# EAGLE design Horn_Board (EAGLE 9.0.1)
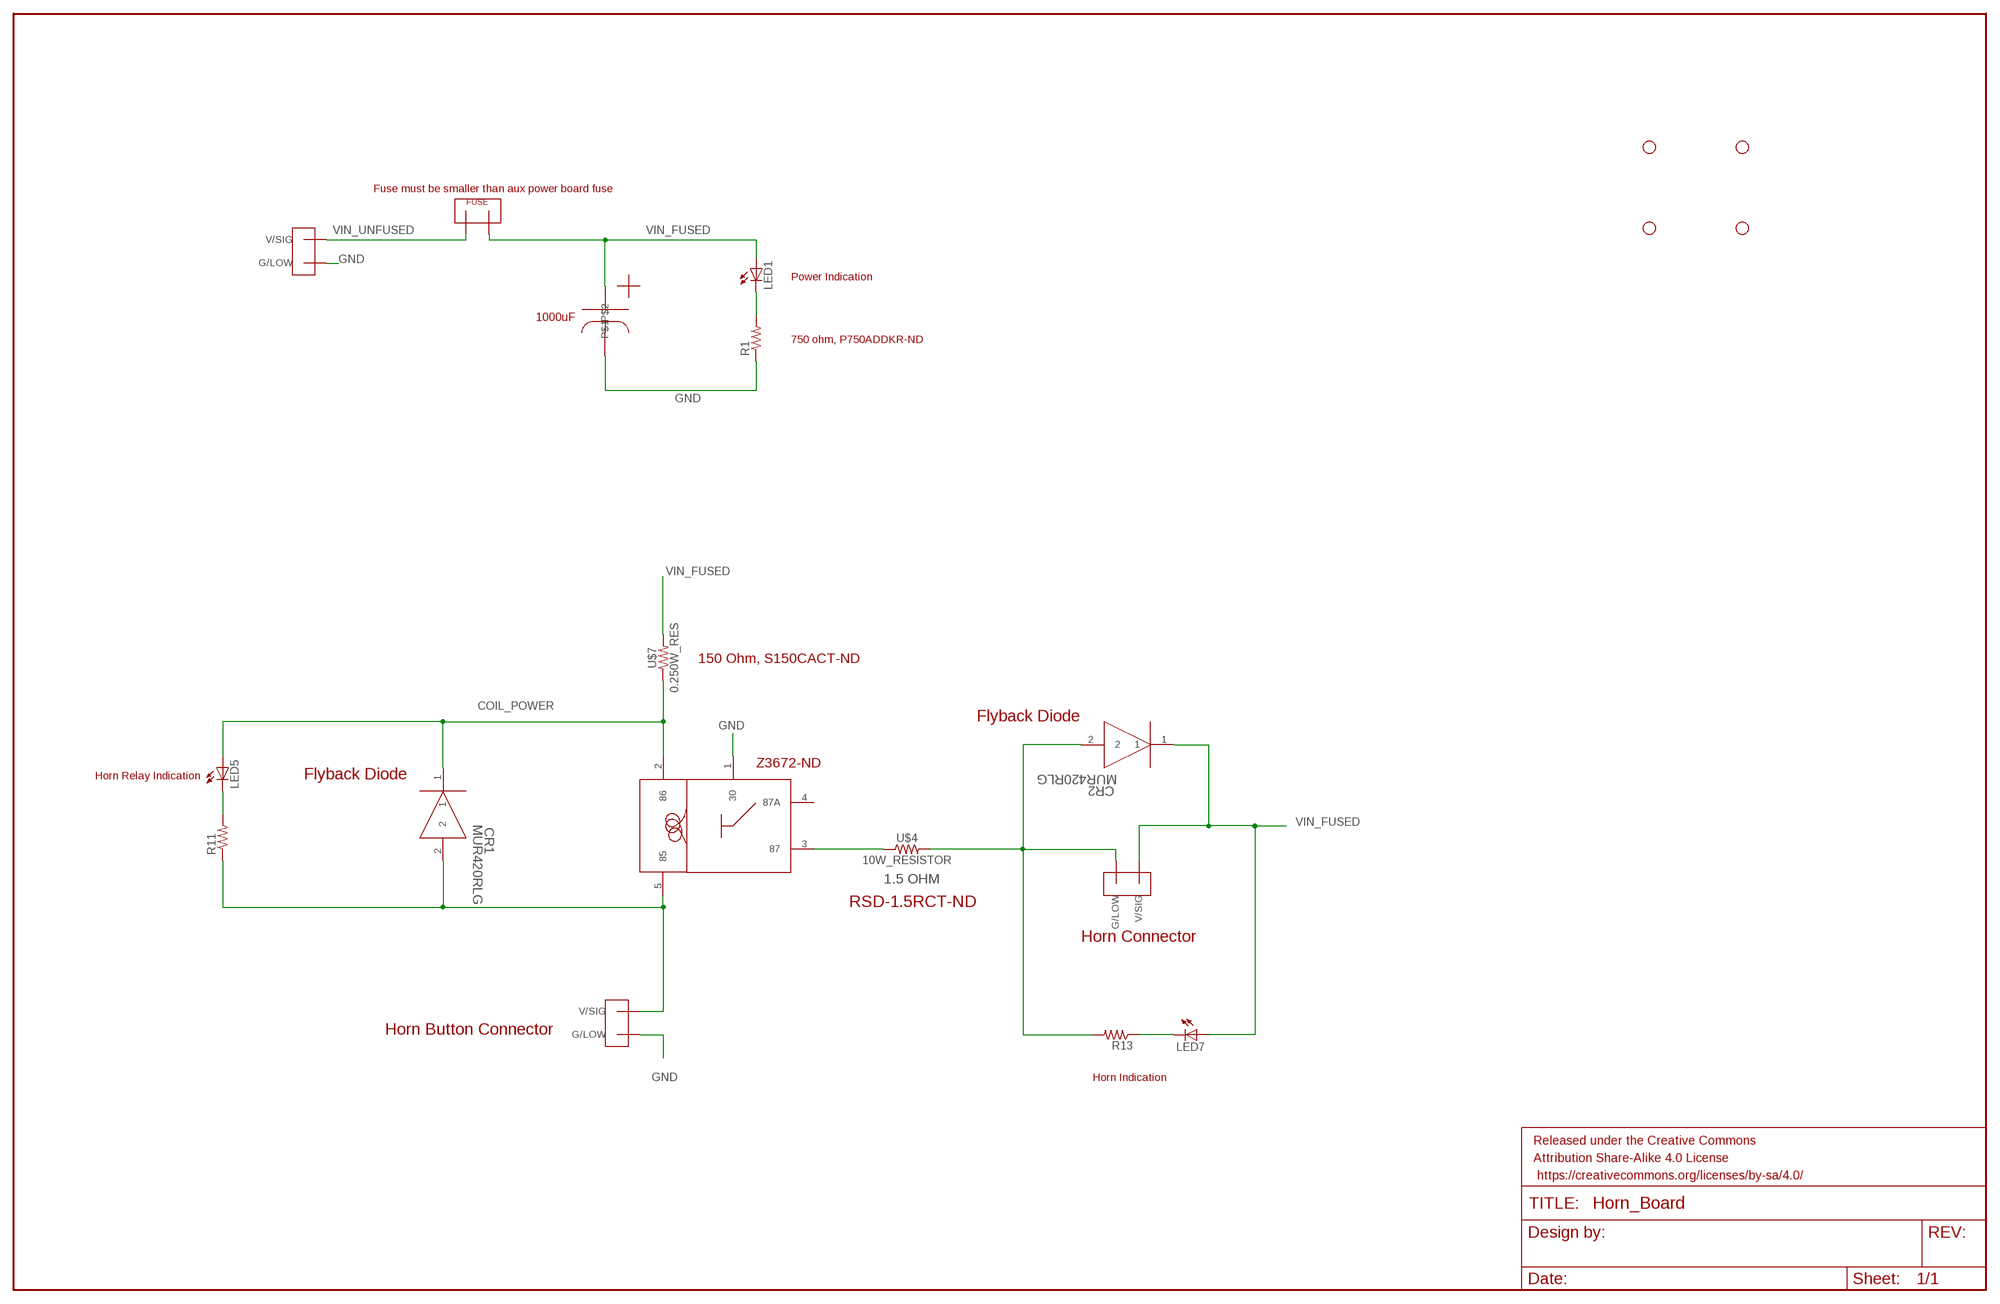
[diagram p0: schematic, sheet 1]

## Parts
CR1  MUR420RLG  [DO-201AD]
CR2  MUR420RLG  [DO-201AD]
FRAME1  FRAME-LEDGER  [CREATIVE_COMMONS]
H1  STAND-OFF  [STAND-OFF]
H2  STAND-OFF  [STAND-OFF]
H3  STAND-OFF  [STAND-OFF]
H4  STAND-OFF  [STAND-OFF]
LED1  LEDCHIP-LED0805  [CHIP-LED0805]
LED5  LEDCHIP-LED0805  [CHIP-LED0805]
LED7  LEDCHIP-LED0805  [CHIP-LED0805]
R1  R-US_M0805  [M0805]
R11  R-US_M0805  [M0805]
R13  R-US_M0805  [M0805]
U$1  TE770966  [2X1-MATE-N-LOCK]
U$2  FUSEMINI-BLADE  [MINI-BLADE-FUSE]
U$3  OMRON_G5LE-1  [OMRON_G5LE-1]
U$4  10W_RESISTOR  [10W_RESISTOR]
U$7  0.250W_RES  [AXIAL-0.3]
U$17  TE770966  [2X1-MATE-N-LOCK]
U$18  TE770966  [2X1-MATE-N-LOCK]
U$22  CAPESK108M025AH4EA  [ESK108M025AH4EA]

## Nets
COIL_POWER: CR1.1 LED5.A U$3.2 U$7.P$1
GND: R1.1 U$1.CIRCUIT2(G/LOW) U$3.1 U$17.CIRCUIT2(G/LOW) U$22.P$2
HORN-: CR2.2 R13.2 U$4.P$2 U$18.CIRCUIT2(G/LOW)
HORN_BUTTON: CR1.2 R11.1 U$3.5 U$17.CIRCUIT1(V/SIG)
N$1: U$3.3 U$4.P$1
N$5: LED1.C R1.2
N$18: LED5.C R11.2
N$20: LED7.C R13.1
VIN_FUSED: CR2.1 LED1.A LED7.A U$2.OUT U$7.P$2 U$18.CIRCUIT1(V/SIG) U$22.P$1
VIN_UNFUSED: U$1.CIRCUIT1(V/SIG) U$2.IN
Unconnected: U$3.4(87A)

## Notes on the sheet
- Fuse must be smaller than aux power board fuse
- Power Indication
- 1000uF
- 750 ohm, P750ADDKR-ND
- 150 Ohm, S150CACT-ND
- Flyback Diode
- Z3672-ND
- Horn Relay Indication | Flyback Diode
- 1.5 OHM
- RSD-1.5RCT-ND
- Horn Connector
- Horn Button Connector
- Horn Indication

## Library data of the parts
CR1 CR2 = MUR420RLG - Diode:MUR420RLG; MANUFACTURER_PART_NUMBER: MUR420RLG; VENDOR: ON Semiconductor
FRAME1 = SparkFun-Aesthetics:FRAME-LEDGER: Schematic Frame - Ledger Standard 11x14 US Ledger frame
H1-H4 = SparkFun-Electromechanical:STAND-OFF: #4 Stand Off This is the mechanical footprint for a #4 phillips button head screw. Use the keepout ring to avoid running the screw head into surrounding components. SKU : PRT-00447
LED1 LED5 LED7 = led:LED: LED OSRAM: - CHIPLED LG R971, LG N971, LY N971, LG Q971, LY Q971, LO R971, LY R971 LH N974, LH R974 LS Q976, LO Q976, LY Q976 LO Q996 - Hyper CHIPLED LW Q18S LB Q993, LB Q99A, LB R99A - SideLED LS A670, LO A670, LY A670, LG A670, LP A670 LB A673, LV A673, LT A673, LW A673 LH A674 LY A675 LS A676, LA A676, LO A676, LY A676, LW A676 LS A679, LY A679, LG A679 - Hyper Micro SIDELED® LS Y876, LA Y876, LO Y876, LY Y876 LT Y87S - SmartLED LW L88C, LW L88S LB L89C, LB L89S, LG L890 LS L89K, LO L89K, LY L89K LS L896, LA L896, LO L896, LY L896 - TOPLED LS T670, LO T670, LY T670, LG T670, LP T670 LSG T670, LSP T670, LSY T670, LOP T670, LYG T670 LG T671, LOG T671, LSG T671 LB T673, LV T673, LT T673, LW T673 LH T674 LS T676, LA T676, LO T676, LY T676, LB T676, LH T676, LSB T676, LW T676 LB T67C, LV T67C, LT T67C, LS T67K, LO T67K, LY T67K, LW E67C LS E67B, LA E67B, LO E67B, LY E67B, LB E67C, LV E67C, LT E67C LW T67C LS T679, LY T679, LG T679 LS T770, LO T770, LY T770, LG T770, LP T770 LB T773, LV T773, LT T773, LW T773 LH T774 LS E675, LA E675, LY E675, LS T675 LS T776, LA T776, LO T776, LY T776, LB T776 LHGB T686 LT T68C, LB T68C - Hyper Mini TOPLED® LB M676 - Mini TOPLED Santana® LG M470 LS M47K, LO M47K, LY M47K Source: http://www.osram.convergy.de LUXEON: - LUMILED® LXK2-PW12-R00, LXK2-PW12-S00, LXK2-PW14-U00, LXK2-PW14-V00 LXK2-PM12-R00, LXK2-PM12-S00, LXK2-PM14-U00 LXK2-PE12-Q00, LXK2-PE12-R00, LXK2-PE12-S00, LXK2-PE14-T00, LXK2-PE14-U00 LXK2-PB12-K00, LXK2-PB12-L00, LXK2-PB12-M00, LXK2-PB14-N00, LXK2-PB14-P00, LXK2-PB14-Q00 LXK2-PR12-L00, LXK2-PR12-M00, LXK2-PR14-Q00, LXK2-PR14-R00 LXK2-PD12-Q00, LXK2-PD12-R00, LXK2-PD12-S00 LXK2-PH12-R00, LXK2-PH12-S00 LXK2-PL12-P00, LXK2-PL12-Q00, LXK2-PL12-R00 Source: www.luxeon.com KINGBRIGHT: KA-3528ASYC Source: www.kingbright.com
R1 R11 R13 = rcl:R-US_: RESISTOR, American symbol; SPICEPREFIX: R
U$1 U$17 U$18 = Shell2013(1):TE770966
U$2 = Shell2013:FUSE
U$3 = Eagle Library:OMRON_G5LE-1
U$4 = Eagle Library:10W_RESISTOR
U$7 = Eagle Library:0.250W_RES
U$22 = Shell2015:CAP

## Board
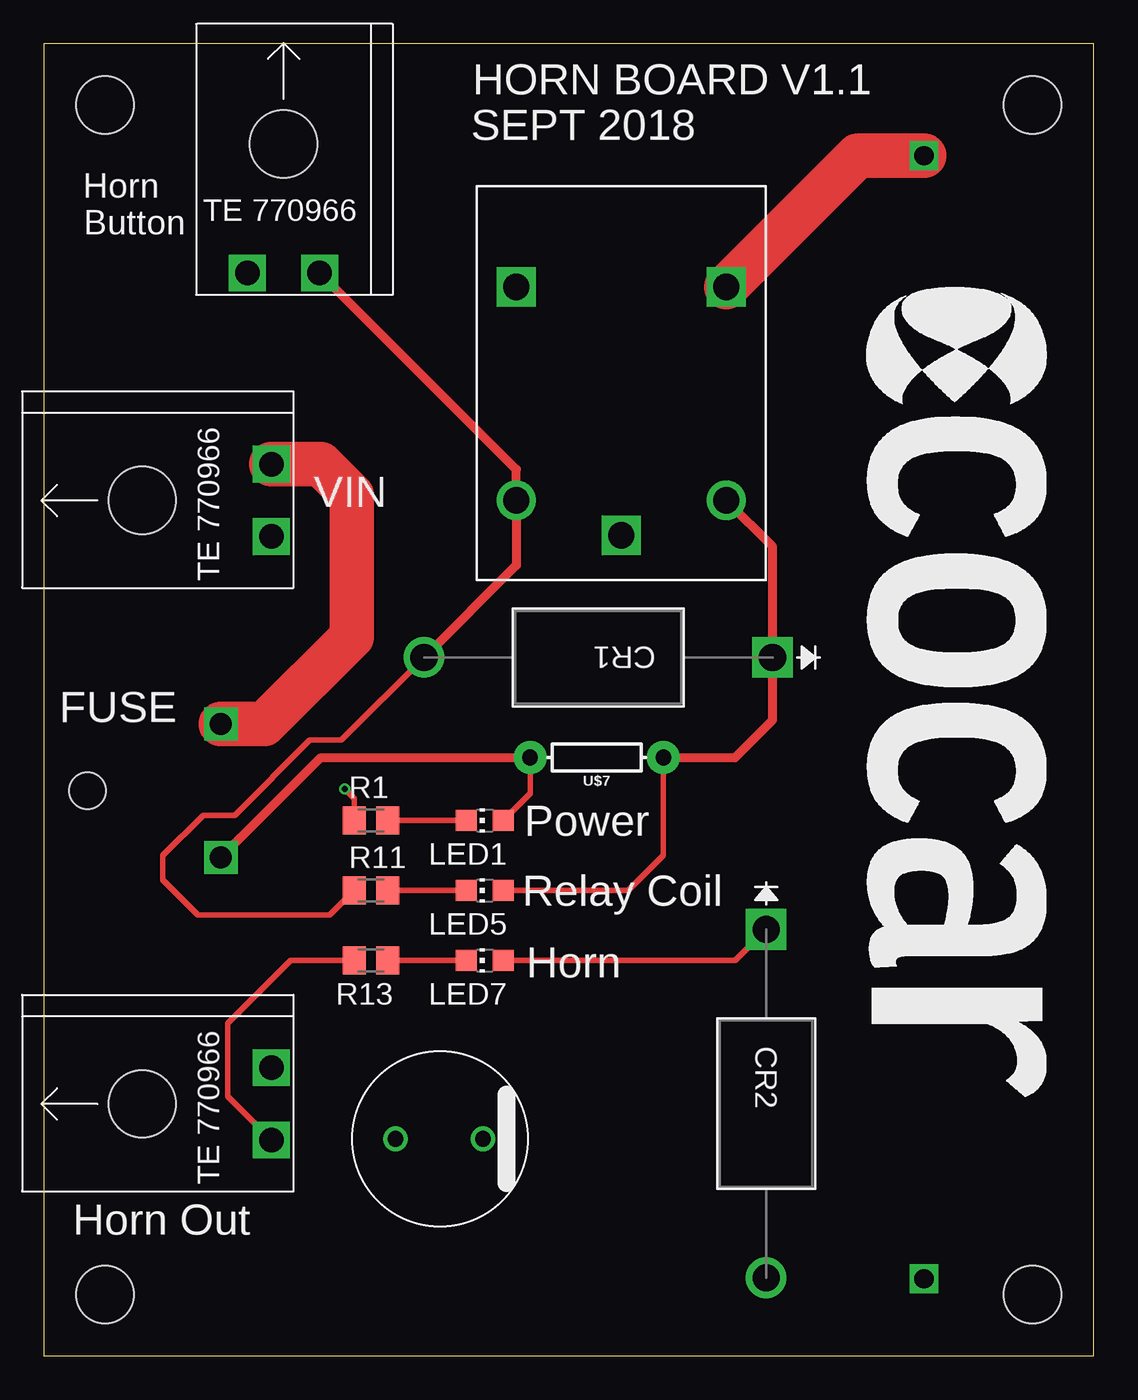
[diagram p1: board, top side]
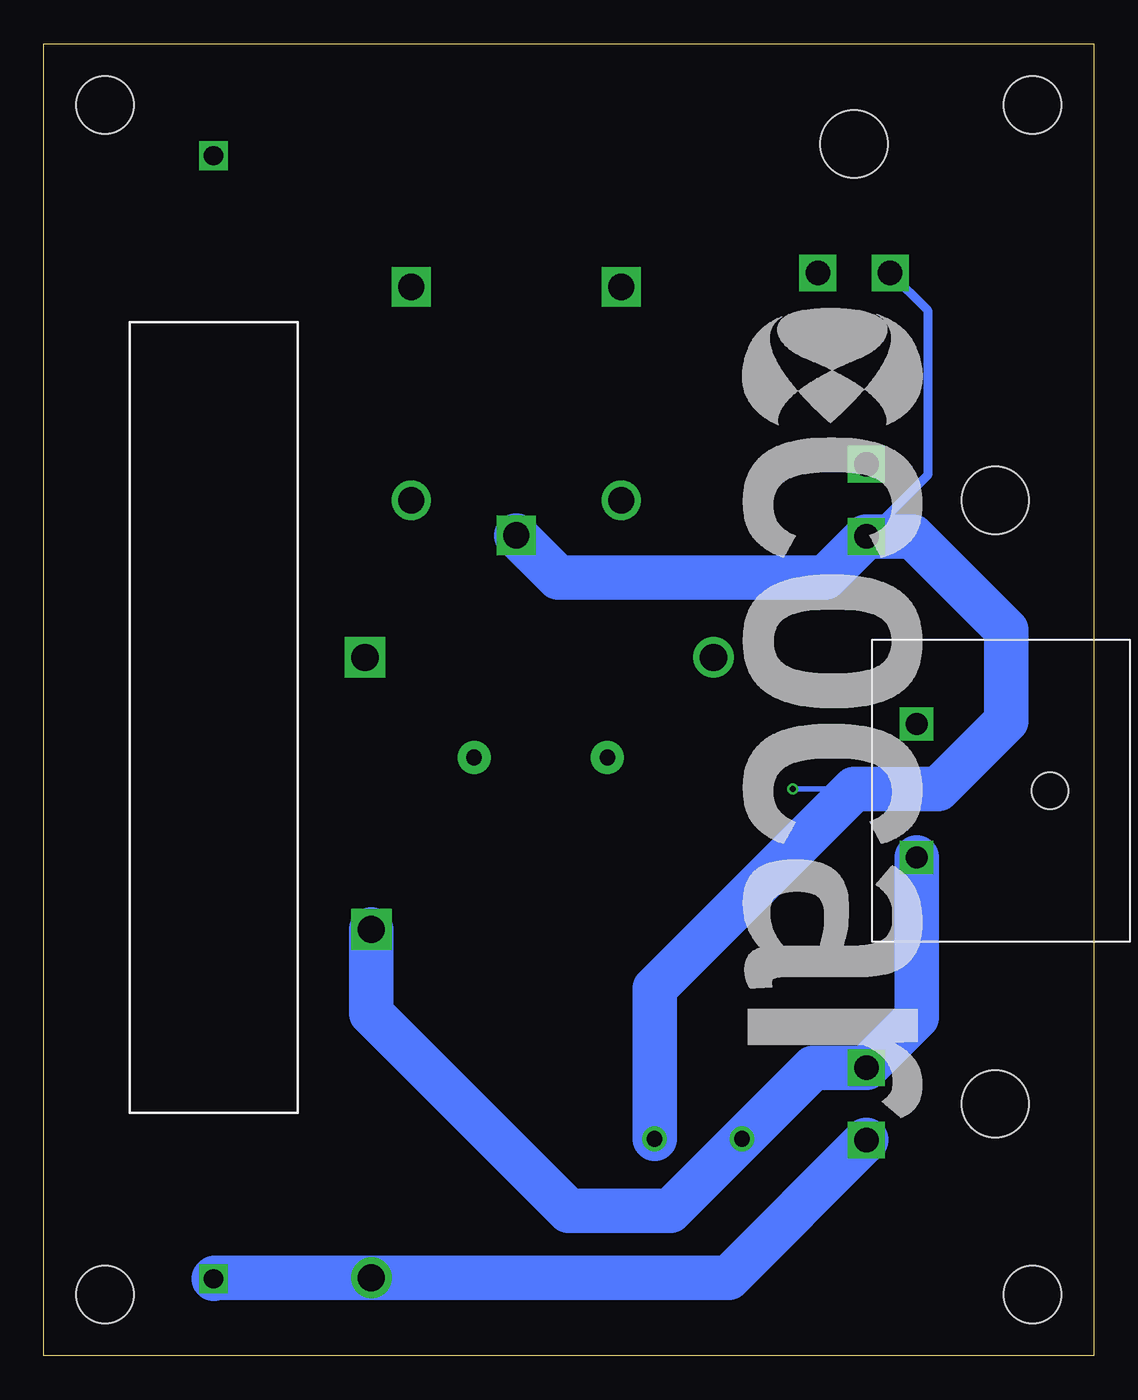
[diagram p2: board, bottom side, seen from below]

Size 60 x 75 mm. Coordinates in mm from the lower left corner, seen from the top.
Outline: 0,0 60,0 60,75 0,75 0,0
Copper layers (1*16): Top 0.035mm / dielectric 1.5mm / Bottom 0.035mm
Design rules "SeeedStudio_2layer_DRU_no_angle_20140221": minimum track width 6mil, minimum drill 12mil, track to track 6mil, track to pad 6mil, pad to pad 6mil, via to via 6mil, smd to smd 0mil, copper to edge 10mil, drill to drill 10mil, minimum pad ring 10mil, minimum via ring 6mil, stop-mask expansion 2mil, vias tented up to drill 100mil, thermal gap 10mil

### Footprints (pad centres in the part's own frame; a part is rotated, then mirrored left to right if it is on the bottom)
DO-201AD = drill 1.549 pad 2.057 square: 1 -19.914,0 | drill 1.549 pad 2.057: 2 0,0
STAND-OFF = hole 3.302: 0,0
CHIP-LED0805 = smd 1.2 x 1.2: A 0,-1.05; C 0,1.05
M0805 = smd 1.3 x 1.6: 1 -0.95,0; 2 0.95,0
2X1-MATE-N-LOCK = drill 1.4 square: CIRCUIT1 -2.07,14.23; CIRCUIT2 2.07,14.23 | hole 3.86: 0,6.86
MINI-BLADE-FUSE = drill 1.27 square: IN 3.81,7.62; OUT -3.81,7.62 | hole 2.083: 0,0
OMRON_G5LE-1 = drill 1.5 square: 1 -8.7,0; 3 5.5,-6; 4 5.5,6 | drill 1.5: 2 -6.7,-6; 5 -6.7,6
10W_RESISTOR = drill 1.1 square: P$1 0,32.1; P$2 0,-32.1
AXIAL-0.3 = drill 0.9 pad 1.88: P$1 -3.81,0; P$2 3.81,0
ESK108M025AH4EA = drill 0.9: P$1 0,0; P$2 5,0

### Placement (x,y rotation side)
CR1  21.73,39.92 180 top
CR2  41.28,4.46 270 top
FRAME1  -80.01,69.85 0 top  (outside the outline)
H1  56.5,71.5 0 top
H2  56.5,3.5 0 top
H3  3.5,71.5 0 top
H4  3.5,3.5 0 top
LED1  25.2,30.6 90 top
LED5  25.2,26.6 90 top
LED7  25.2,22.6 90 top
R1  18.7,30.6 0 top
R11  18.7,26.6 0 top
R13  18.7,22.6 180 top
U$1  -1.23,48.9 270 top
U$2  2.5,32.3 90 bottom
U$3  33,55.6 90 top
U$4  50.3,36.5 0 bottom
U$5  [ECOCAR_LOGO_2018]  20.1,59.9 270 bottom
U$7  31.6,34.2 180 top
U$14  [ECOCAR_LOGO_2018]  47,61.1 270 top
U$17  13.7,76.13 180 top
U$18  -1.23,14.4 270 top
U$22  20.1,12.4 0 top

### Tracks (layer width: path | path; a pad name or v marks a point on that pad's centre or on a via)
COIL_POWER
  Top 0.305: LED5.A 33.4,26.6 35.41,28.61 U$7.P$1
  Top 0.508: U$7.P$1 39.5,34.2 41.64,36.34 CR1.1 41.64,46.26 U$3.2
GND  (via drill 0.35)
  Top 0.305: R1.1 17.75,31.85 v17.2,32.4
  Bottom 0.305: v17.2,32.4 13.7,32.4
  Bottom 0.508: U$17.CIRCUIT2 9.5,59.77 9.5,50.33 U$1.CIRCUIT2
  Bottom 2.54: U$3.1 30.6,44.5 15.33,44.5 U$1.CIRCUIT2 10.33,46.83 5,41.5 5,36.3 8.9,32.4 13.7,32.4 25.1,21 U$22.P$2
HORN-
  Top 0.305: U$18.CIRCUIT2 10.5,14.83 10.5,19 14.1,22.6 R13.2
  Bottom 2.54: U$18.CIRCUIT2 20.87,4.46 CR2.2 50.24,4.46 U$4.P$2
HORN_BUTTON
  Top 0.305: CR1.2 17.01,35.2 15.2,35.2 10.9,30.9 9.1,30.9 6.8,28.6 6.8,27.2 8.8,25.2 16.35,25.2 R11.1
  Top 0.508: U$17.CIRCUIT1 27,50.67 U$3.5 27,45.19 CR1.2
N$1
  Top 2.54: U$4.P$1 46.5,68.6 U$3.3
N$5
  Top 0.305: R1.2 LED1.C
N$18
  Top 0.305: R11.2 LED5.C
N$20
  Top 0.305: R13.1 LED7.C
VIN_FUSED
  Top 0.305: LED7.A 39.51,22.6 CR2.1 | LED1.A 27.79,32.14 U$7.P$2
  Top 0.508: U$2.OUT 15.83,34.2 U$7.P$2
  Bottom 2.54: U$2.OUT 10.12,19.35 U$18.CIRCUIT1 16.03,16.47 U$22.P$1 24.2,8.3 30,8.3 41.28,19.58 CR2.1
VIN_UNFUSED
  Top 2.54: U$1.CIRCUIT1 15.83,50.97 17.6,49.2 17.6,41.1 12.61,36.11 U$2.IN

### Text on the board
tPlace: HORN BOARD V1.1 | SEPT 2018 | Horn | Button | VIN | FUSE | Power | Relay Coil | Horn | Horn Out